# EAGLE design DCCInterface (EAGLE 8.3.1)
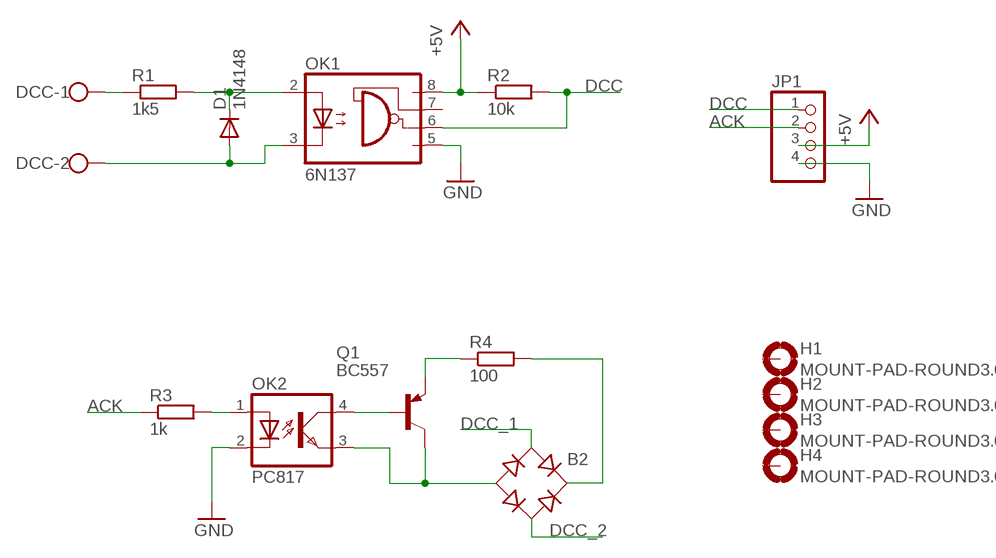
[diagram p0: schematic, sheet 1]

## Parts
B2  RB1A  [RB1A]
D1  1N4148  1N4148DO35-10  [DO35-10]
DCC  W237-102  [W237-102]
H1  MOUNT-PAD-ROUND3.0  [3,0-PAD]
H2  MOUNT-PAD-ROUND3.0  [3,0-PAD]
H3  MOUNT-PAD-ROUND3.0  [3,0-PAD]
H4  MOUNT-PAD-ROUND3.0  [3,0-PAD]
JP1  PINHD-1X4  [1X04]
OK1  6N137  [DIL08]
OK2  PC817  [DIL04]
Q1  BC557  [TO92]
R1  1k5  R-EU_0207/10  [0207/10]
R2  10k  R-EU_0207/10  [0207/10]
R3  1k  R-EU_0207/10  [0207/10]
R4  100  R-EU_0207/10  [0207/10]

## Nets
+5V: JP1.3 OK1.8(VCC) R2.1
ACK: JP1.2 R3.1
DCC: JP1.1 OK1.6(VO) R2.2
DCC_1: B2.AC1 DCC.1 R1.1
DCC_2: B2.AC2 D1.A DCC.2 OK1.3(C)
GND: JP1.4 OK1.5(GND) OK2.2(C)
N$1: B2.- OK2.3(EMIT) Q1.3(C)
N$2: D1.C OK1.2(A) R1.2
N$8: OK2.1(A) R3.2
N$9: OK2.4(COL) Q1.2(B)
N$10: Q1.1(E) R4.1
N$11: B2.+ R4.2
Unconnected: H1.B3,0(MOUNT) H2.B3,0(MOUNT) H3.B3,0(MOUNT) H4.B3,0(MOUNT) OK1.7(VE)

## Library data of the parts
B2 = rectifier:RB1A: RECTIFIER 1 A
D1 = diode:1N4148: DIODE high speed (Philips)
DCC = con-wago-500:W237-102: WAGO SCREW CLAMP; MPN: 237-102; OC_FARNELL: unknown; OC_NEWARK: 70K9898
H1-H4 = holes:MOUNT-PAD-ROUND: MOUNTING PAD, round
JP1 = pinhead:PINHD-1X4: PIN HEADER
OK1 = optocoupler:6N137: MOTOROLA OPTO COUPLER; MPN: 6N137; OC_FARNELL: 1328376; OC_NEWARK: 52M1895
OK2 = optocoupler:PC817: SHARP OPTO COUPLER; MPN: PC817X4J000F; OC_FARNELL: 9707727; OC_NEWARK: 97K7059
Q1 = transistor-pnp:BC557: PNP Transistor
R1-R4 = rcl:R-EU_: RESISTOR, European symbol

## Board
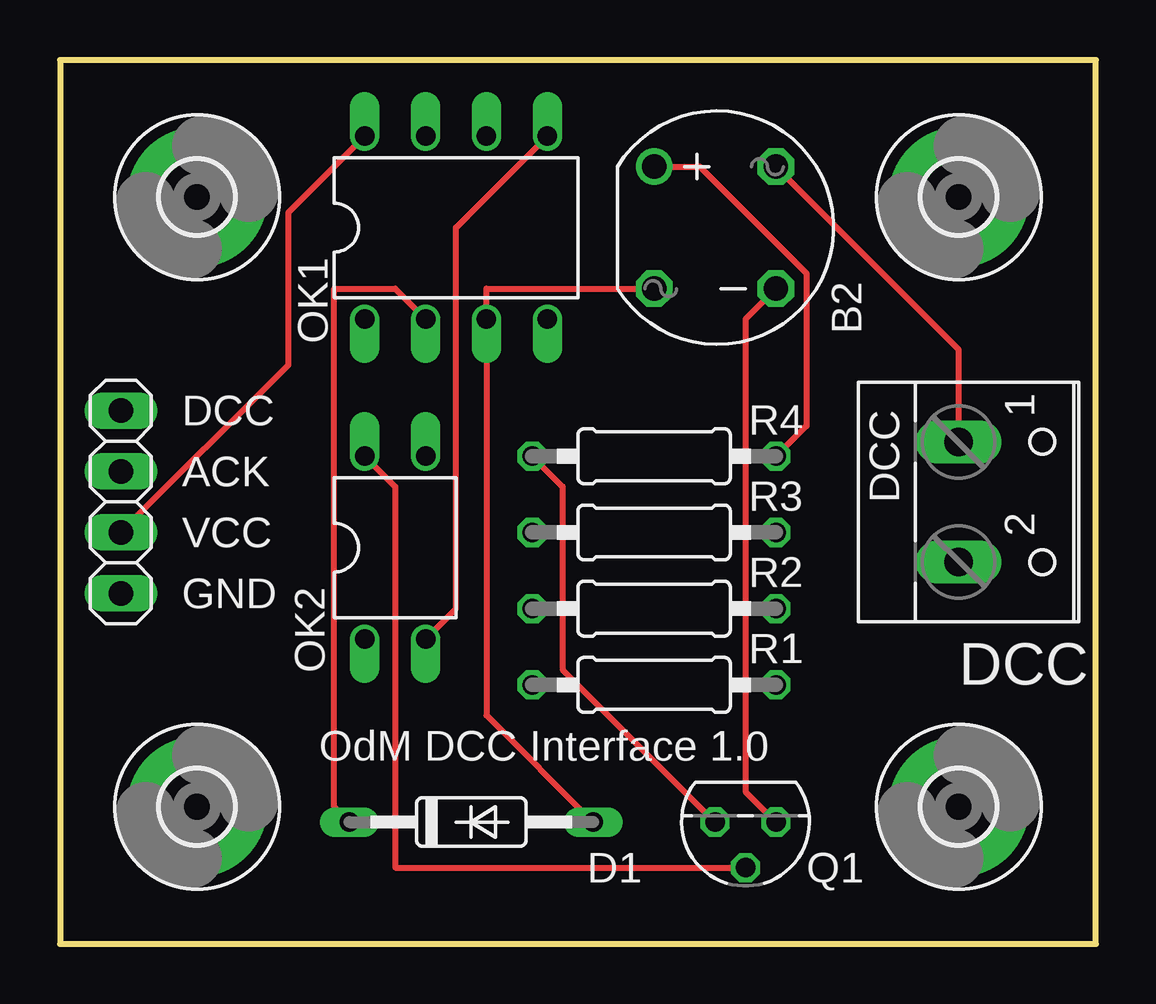
[diagram p1: board, top side]
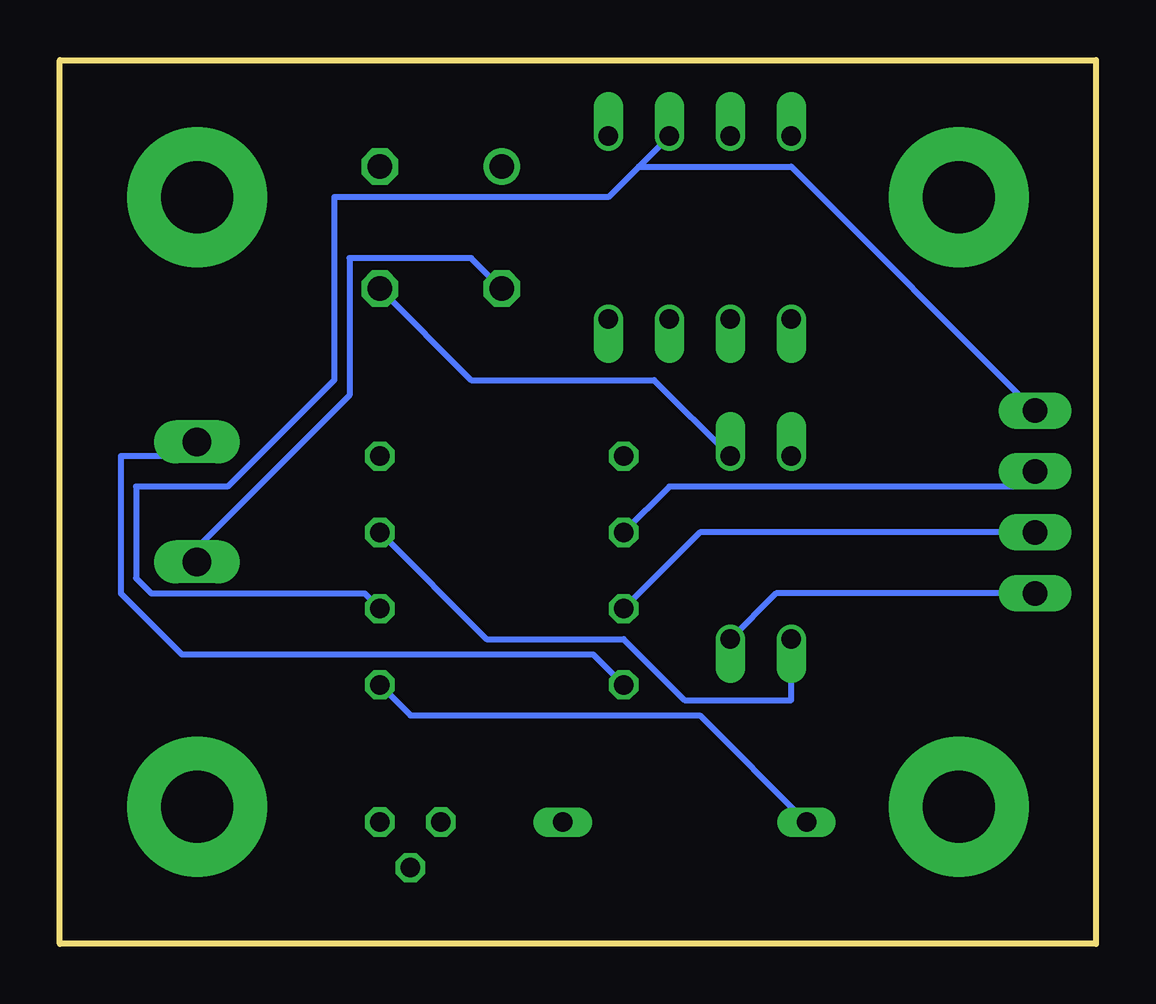
[diagram p2: board, bottom side, seen from below]

Size 43.18 x 36.83 mm. Coordinates in mm from the lower left corner, seen from the top.
Outline: 43.18,36.83 0,36.83 0,0 43.18,0 43.18,36.83
Copper layers (1*16): Top 0.035mm / dielectric 1.6mm / Bottom 0.035mm
Design rules "Elecrow_2-layer_PCB_eagle_rule *": minimum track width 10mil, minimum drill 12mil, track to track 10mil, track to pad 10mil, pad to pad 12mil, via to via 12mil, smd to smd 0mil, copper to edge 20mil, drill to drill 10mil, minimum pad ring 6mil, minimum via ring 6mil, stop-mask expansion 0mil, vias tented up to drill 100mil, thermal gap 10mil

### Footprints (pad centres in the part's own frame; a part is rotated, then mirrored left to right if it is on the bottom)
RB1A = drill 1.016: + -2.54,2.54 | drill 1.016 octagon: - 2.54,-2.54; AC1 2.54,2.54; AC2 -2.54,-2.54
DO35-10 = drill 0.813 long: A 5.08,0; C -5.08,0
W237-102 = drill 1.194 long: 1 -2.5,-1.27; 2 2.5,-1.27
3,0-PAD = drill 3 pad 5.842: B3,0 0,0
1X04 = drill 1.016 long: 1 -3.81,0; 2 -1.27,0; 3 1.27,0; 4 3.81,0
DIL08 = drill 0.813 offset: 1 -3.81,-3.81; 2 -1.27,-3.81; 3 1.27,-3.81; 4 3.81,-3.81; 5 3.81,3.81; 6 1.27,3.81; 7 -1.27,3.81; 8 -3.81,3.81
DIL04 = drill 0.813 offset: 1 -1.27,-3.81; 2 1.27,-3.81; 3 1.27,3.81; 4 -1.27,3.81
TO92 = drill 0.813 octagon: 1 1.27,0; 2 0,1.905; 3 -1.27,0
0207/10 = drill 0.813 octagon: 1 -5.08,0; 2 5.08,0

### Placement (x,y rotation side)
B2  27.3,29.84 0 top
D1  17.14,5.08 0 top
DCC  38.73,18.41 270 top
H1  37.47,5.71 0 top
H2  5.71,5.71 0 top
H3  37.47,31.11 0 top
H4  5.71,31.11 0 top
JP1  2.54,18.41 270 top
OK1  16.51,29.84 0 top
OK2  13.97,16.51 0 top
Q1  28.57,5.08 180 top
R1  24.76,10.79 0 top
R2  24.76,13.97 0 top
R3  24.76,17.14 0 top
R4  24.76,20.32 0 top

### Tracks (layer width: path | path; a pad name or v marks a point on that pad's centre or on a via)
+5V
  Top 0.254: OK1.8 9.52,30.48 9.52,24.13 JP1.3
  Bottom 0.254: R2.1 16.51,17.14 JP1.3
ACK
  Bottom 0.254: R3.1 17.78,19.05 3.18,19.05 JP1.2
DCC
  Bottom 0.254: R2.2 30.48,14.61 39.37,14.61 40,15.24 40,19.05 36.19,19.05 31.75,23.5 31.75,31.11 20.32,31.11 19.05,32.38 | OK1.6 19.05,32.38 | JP1.1 12.7,32.38 19.05,32.38
DCC_1
  Top 0.254: B2.AC1 37.47,24.77 DCC.1
  Bottom 0.254: R1.1 20.96,12.06 38.1,12.06 40.64,14.61 40.64,20.32 37.47,20.32 DCC.1
DCC_2
  Top 0.254: D1.A 17.78,9.53 OK1.3 17.78,27.3 B2.AC2
  Bottom 0.254: B2.AC2 26.04,28.57 31.11,28.57 31.11,22.86 37.47,16.51 DCC.2
GND
  Top 0.254: OK1.5 16.51,29.84 16.51,13.97 OK2.2
  Bottom 0.254: OK2.2 13.33,14.61 JP1.4
N$1
  Top 0.254: Q1.3 28.57,6.35 28.57,26.04 B2.-
  Bottom 0.254: OK2.3 18.42,23.5 26.04,23.5 B2.-
N$2
  Top 0.254: OK1.2 13.97,27.3 11.43,27.3 11.43,5.71 D1.C
  Bottom 0.254: D1.C 16.51,9.53 28.57,9.53 R1.2
N$8
  Bottom 0.254: OK2.1 12.7,10.16 17.14,10.16 19.68,12.7 25.4,12.7 R3.2
N$9
  Top 0.254: Q1.2 13.97,3.17 13.97,19.05 OK2.4
N$10
  Top 0.254: Q1.1 20.96,11.43 20.96,19.05 R4.1
N$11
  Top 0.254: R4.2 31.11,21.59 31.11,27.94 26.67,32.38 B2.+

### Text on the board
tNames: DCC | ACK | VCC | GND | DCC | OdM DCC Interface 1.0